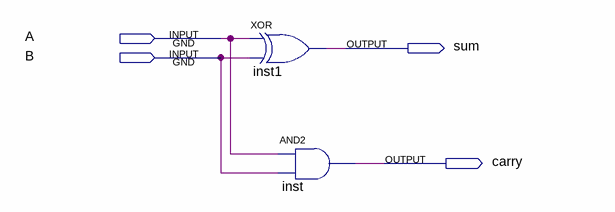
[diagram p0: schematic sheet]
// Quartus schematic half_adder.bdf as structural Verilog: 2 symbols, 4 pins
module half_adder (
  input  A,
  input  B,
  output sum,
  output carry
);

  xor inst1 (sum, A, B);
  and inst (carry, A, B);
endmodule
